# EAGLE schematic Dynamixel (EAGLE 9.6.2)
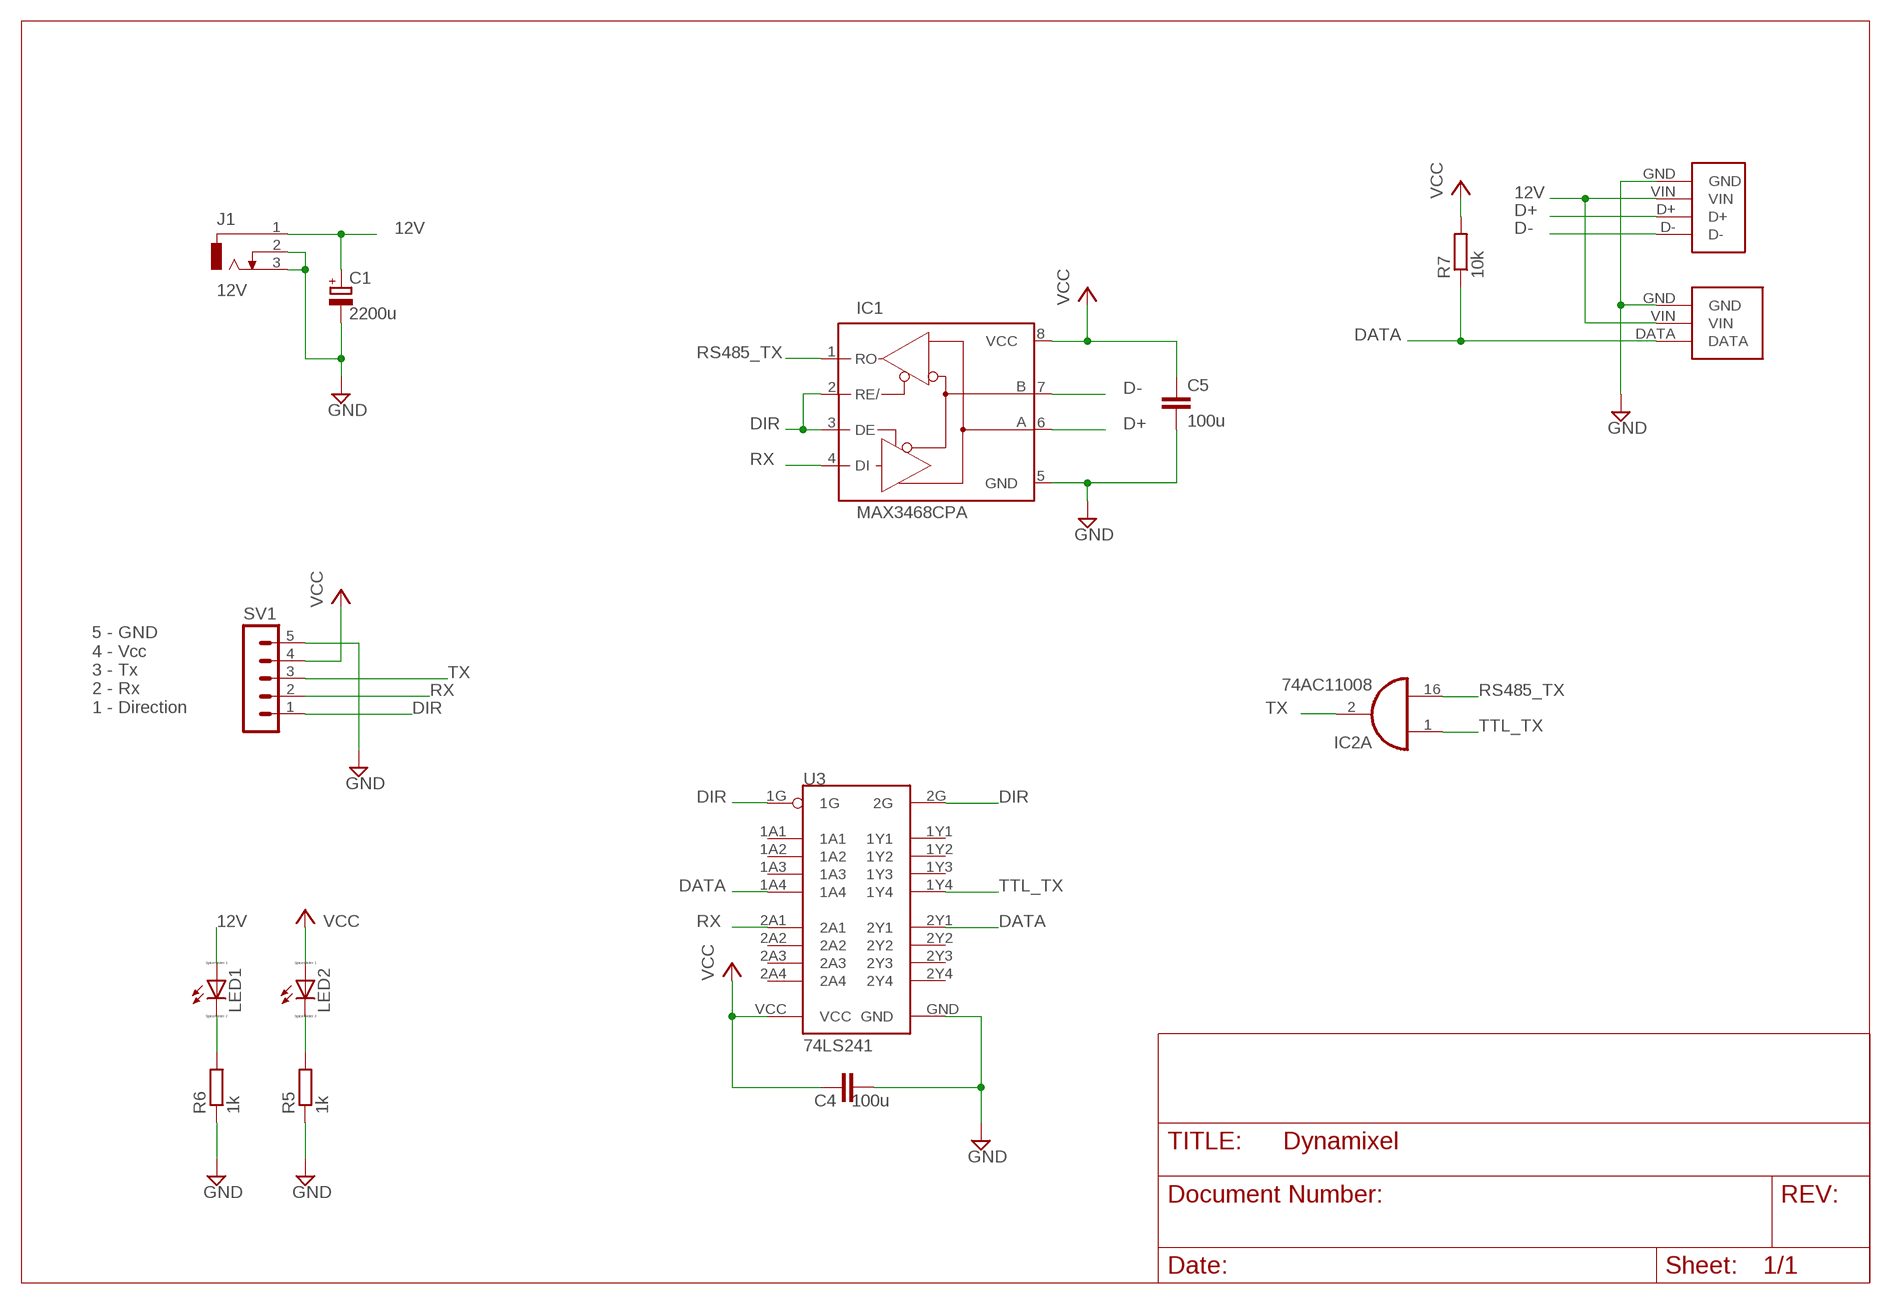
[diagram p0: schematic, sheet 1]

## Parts
C1  2200u  CPOL-EUE5-13  [E5-13]
C4  100u  C-EUC0805  [C0805]
C5  100u  C-EUC0805  [C0805]
IC1  MAX3468CPA  [DIL08]
IC2  74AC11008  [DIL16]
J1  12V  DCJ0303  [DCJ0303]
LED1  LED_ELD260  [LED_LD260]
LED2  LED_ELD260  [LED_LD260]
R5  1k  R-EU_R0805  [R0805]
R6  1k  R-EU_R0805  [R0805]
R7  10k  R-EU_R0805  [R0805]
SV1  MA05-1  [MA05-1]
U3  74LS241-N  [74LS241-N]
U$1  DYN-RA-3  [DYN-RA-3]
U$2  DYN-RA-4  [DYN-RA-4]

## Nets
12V: C1.+ J1.1 LED1.A U$1.VIN U$2.VIN
D+: IC1.6(A) U$2.D+
D-: IC1.7(B) U$2.D-
DATA: R7.1 U3.1A4 U3.2Y1 U$1.DATA
DIR: IC1.2(RE/) IC1.3(DE) SV1.1 U3.1G U3.2G
GND: C1.- C4.2 C5.2 IC1.5(GND) J1.2 J1.3 R5.1 R6.1 SV1.5 U3.GND U$1.GND U$2.GND
N$6: LED1.K(C) R6.2
N$7: LED2.K(C) R5.2
RS485_TX: IC1.1(RO) IC2.16(A:I1)
RX: IC1.4(DI) SV1.2 U3.2A1
TTL_TX: IC2.1(A:I0) U3.1Y4
TX: IC2.2(A:O) SV1.3
VCC: C4.1 C5.1 IC1.8(VCC) LED2.A R7.2 SV1.4 U3.VCC
Unconnected: IC2.3(B:O) IC2.6(C:O) IC2.7(D:O) IC2.8(D:I1) IC2.9(D:I0) IC2.10(C:I1) IC2.11(C:I0) IC2.14(B:I1) IC2.15(B:I0) U3.1A1 U3.1A2 U3.1A3 U3.1Y1 U3.1Y2 U3.1Y3 U3.2A2 U3.2A3 U3.2A4 U3.2Y2 U3.2Y3 U3.2Y4

## Notes on the sheet
- 5 - GND
  4 - Vcc
  3 - Tx
  2 - Rx
  1 - Direction

## Power pins joined to a net without a drawn wire
GND: IC2.4(P:GND) IC2.5(P:GND)
VCC: IC2.12(P:VCC) IC2.13(P:VCC)

## Library data of the parts
C1 = rcl:CPOL-EU: POLARIZED CAPACITOR, European symbol; SPICEPREFIX: C
C4 C5 = rcl:C-EU: CAPACITOR, European symbol; SPICEPREFIX: C
IC1 = maxim:MAX34*: +5V, Fail-Safe, 40Mbps, Profibus RS-485/RS-422 Transceivers Source: MAX3465-MAX3469.pdf; OC_FARNELL: unknown; OC_NEWARK: unknown
IC2 = 74ac-logic:74AC11008: Quadruple 2-input AND
J1 = con-jack:DCJ0303: DC POWER JACK Source: DCJ0303.pdf; OC_FARNELL: unknown; OC_NEWARK: unknown
LED1 LED2 = eagle-ltspice:LED_E: LED Source: http://www.osram.convergy.de Source: www.luxeon.com Source: www.kingbright.com; SPICEMODEL: NONE; SPICEPREFIX: D; SPICETYPE: diode
R5-R7 = resistor:R-EU_: RESISTOR, European symbol
SV1 = con-lstb:MA05-1: PIN HEADER; OC_FARNELL: unknown; OC_NEWARK: unknown
U3 = DynamixelLibrary:74LS241-N: The 74LS241-N communicator chip used primarily with Dynamixel AX-12 servo motors.
U$1 = DynamixelLibrary:DYN-RA-3
U$2 = DynamixelLibrary:DYN-RA-4

## Module TX
Ports: 

### Library data of the parts